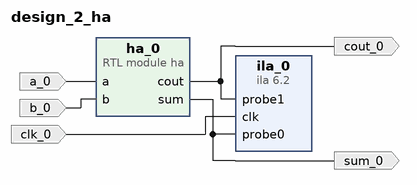
[diagram p0: block diagram of the top level]
# Vivado block design design_2_ha, xc7a100tcsg324-1, Vivado 2022.1
create_bd_design design_2_ha

create_bd_port -dir I a_0
create_bd_port -dir I b_0
create_bd_port -dir O cout_0
create_bd_port -dir O sum_0
create_bd_port -dir I -type clk clk_0

create_bd_cell -type module -reference ha ha_0
create_bd_cell -type ip -vlnv xilinx.com:ip:ila:6.2 ila_0
set_property -dict [list \
  CONFIG.ALL_PROBE_SAME_MU_CNT 2 \
  CONFIG.C_ADV_TRIGGER true \
  CONFIG.C_ENABLE_ILA_AXI_MON false \
  CONFIG.C_EN_STRG_QUAL 1 \
  CONFIG.C_MONITOR_TYPE Native \
  CONFIG.C_NUM_OF_PROBES 2 \
  CONFIG.C_PROBE0_MU_CNT 2 \
  CONFIG.C_PROBE1_MU_CNT 2 \
] [get_bd_cells ila_0]

# ---- connections ----

connect_bd_net -net a_0_1 [get_bd_ports a_0] [get_bd_pins ha_0/a]
connect_bd_net -net b_0_1 [get_bd_ports b_0] [get_bd_pins ha_0/b]
connect_bd_net -net clk_0_1 [get_bd_ports clk_0] [get_bd_pins ila_0/clk]
connect_bd_net [get_bd_pins ha_0/cout] [get_bd_ports cout_0] [get_bd_pins ila_0/probe1]
connect_bd_net [get_bd_pins ha_0/sum] [get_bd_ports sum_0] [get_bd_pins ila_0/probe0]

validate_bd_design
save_bd_design
